# EAGLE board SNCHN_II-02p (EAGLE 5.11), part 1 of 2
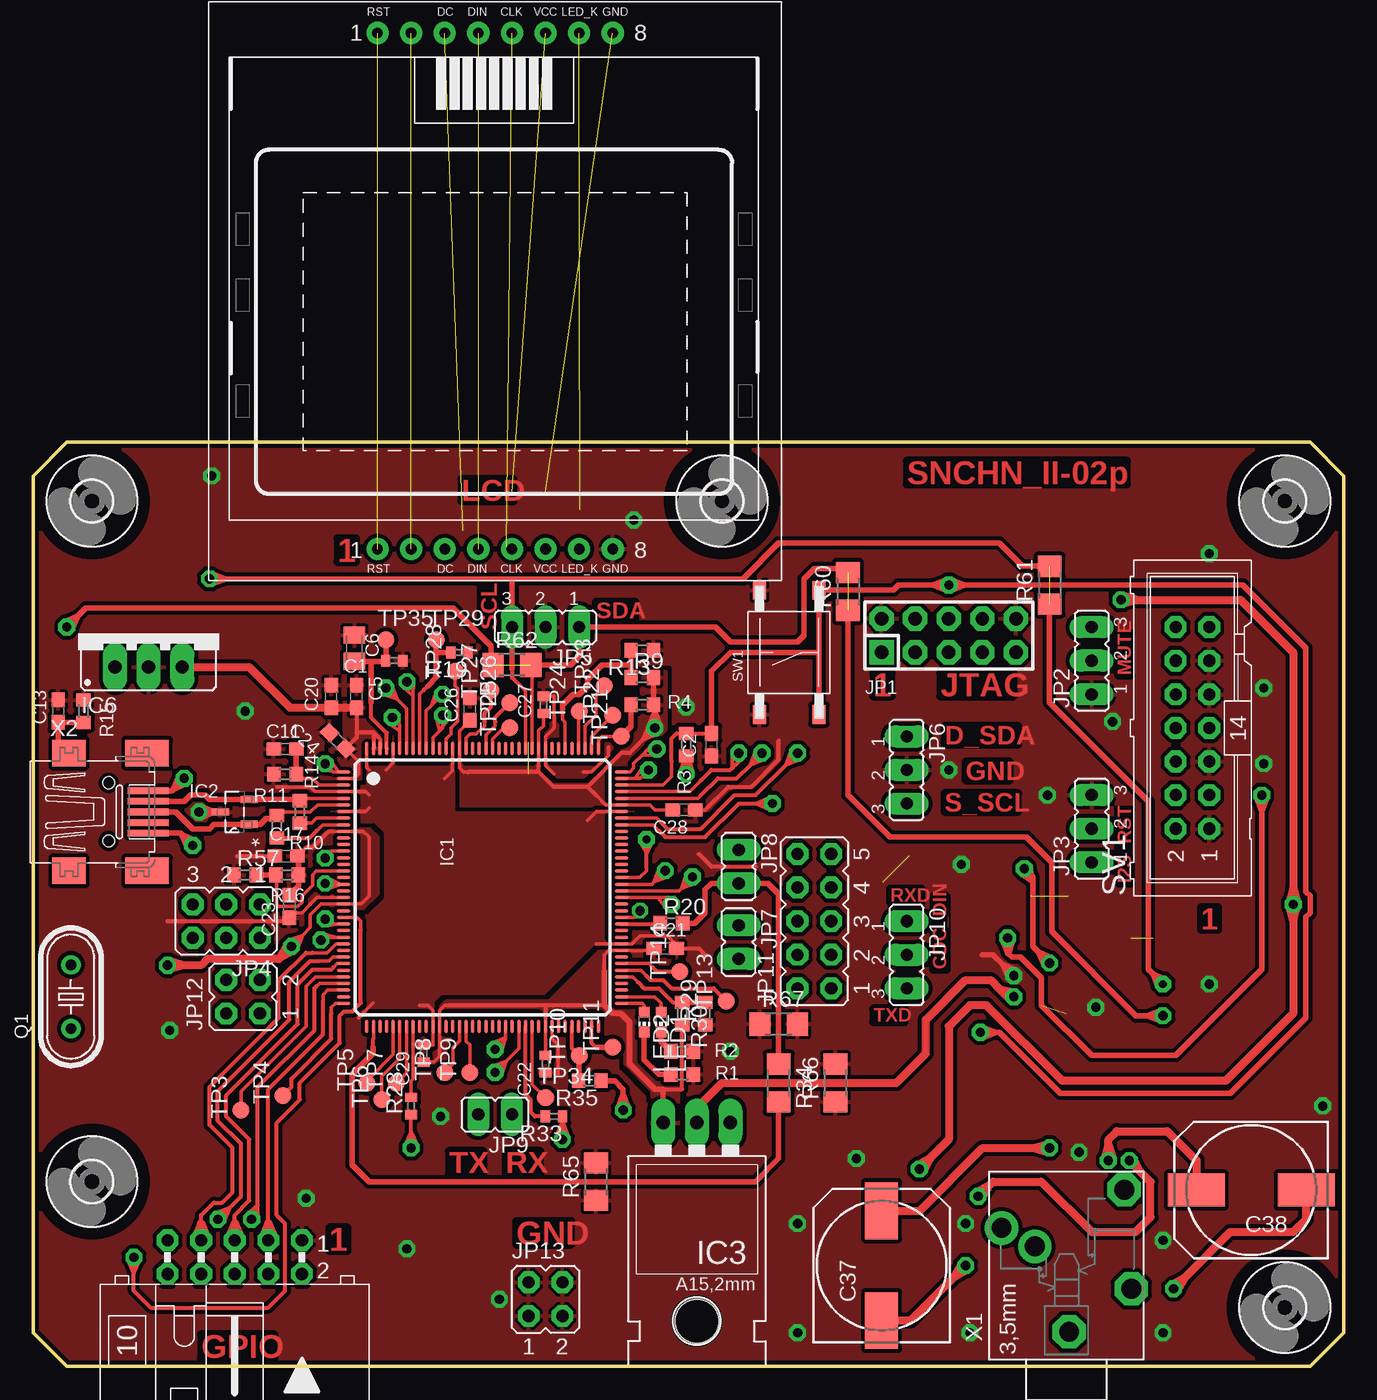
[diagram p2: board, top side]
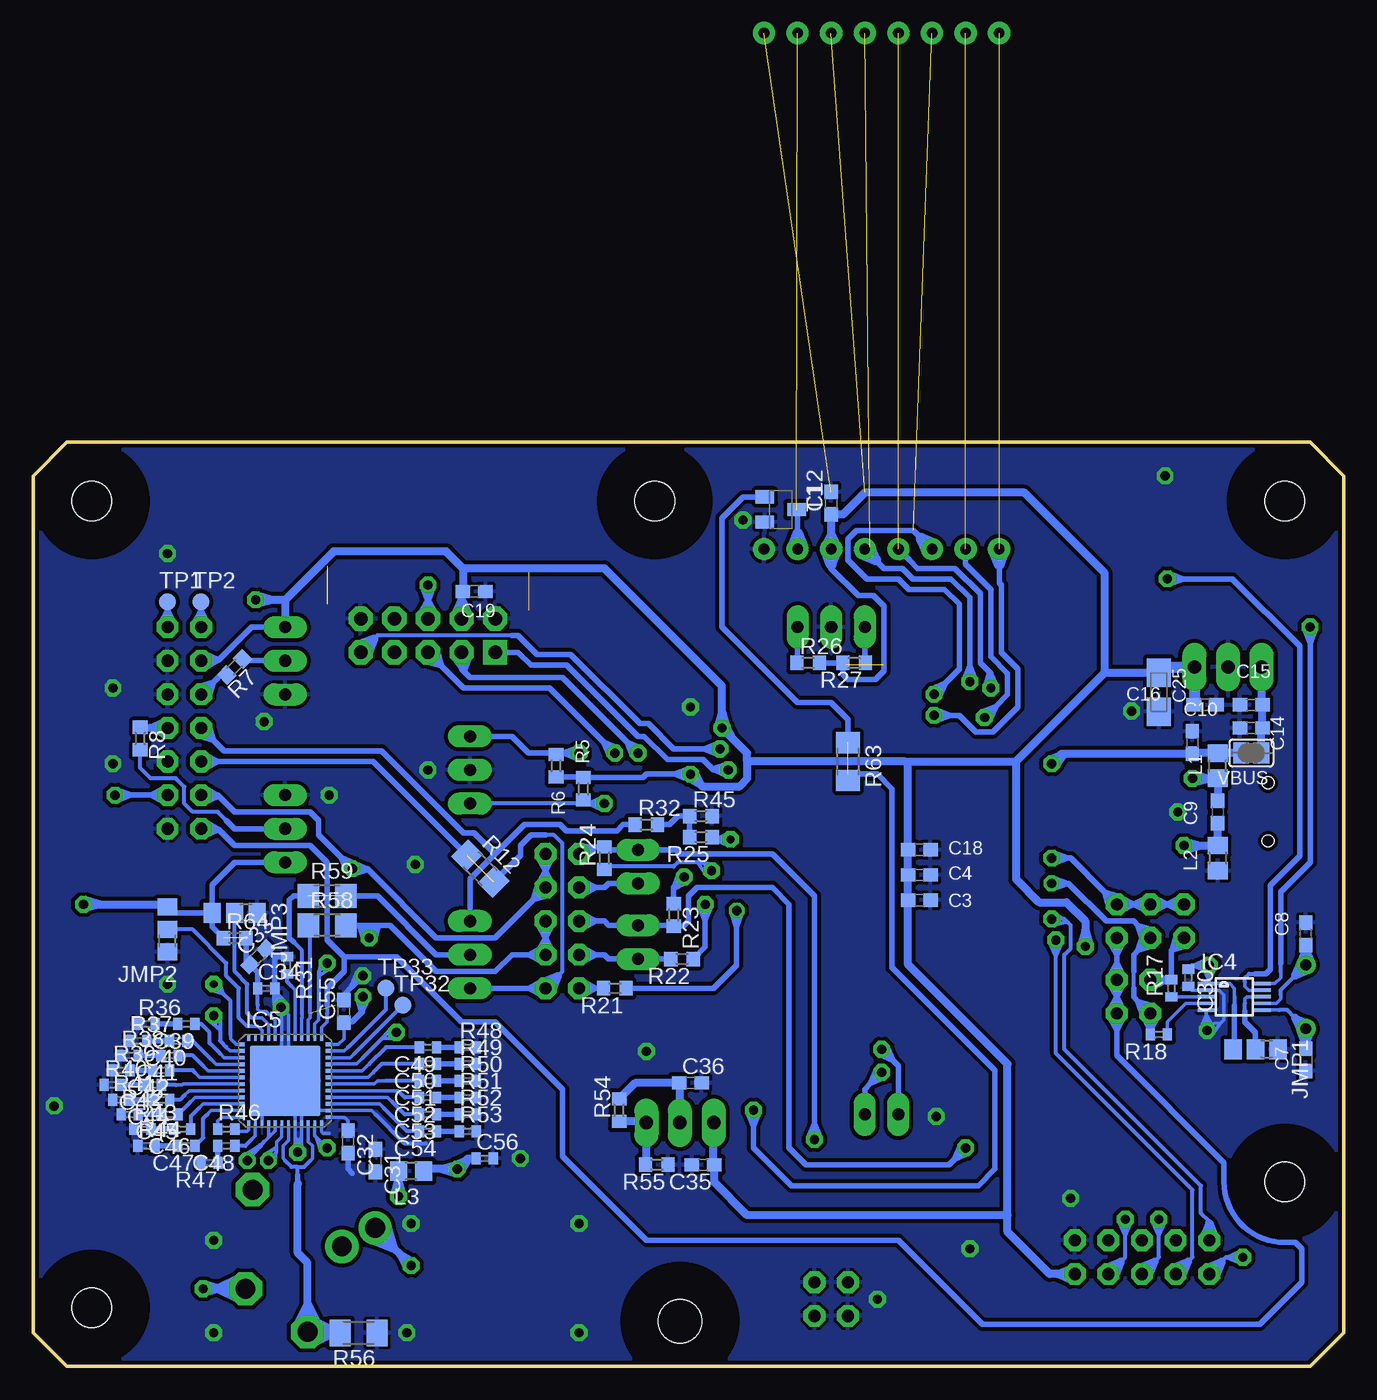
[diagram p3: board, bottom side, seen from below]

Size 99.06 x 69.85 mm. Coordinates in mm from the lower left corner, seen from the top.
Outline: 0,2.54 2.54,0 96.52,0 99.06,2.54 99.06,67.31 96.52,69.85 2.54,69.85 0,67.31 0,2.54
Copper layers (1*16): Top 0.035mm / dielectric 1.5mm / Bottom 0.035mm
Design rules "default *": minimum track width 0.2mm, minimum drill 0.5mm, track to track 0.2mm, track to pad 0.2mm, pad to pad 0.2mm, via to via 0.2mm, smd to smd 0.2mm, copper to edge 0.3mm, drill to drill 8mil, minimum pad ring 10mil, minimum via ring 8mil, stop-mask expansion 4mil, vias tented up to drill 0.6mm, thermal gap 10mil
tRestrict: area 25.6,45.7 to 26.8,45.9; area 27.6,45.7 to 31.3,45.9; area 32.7,45.7 to 37.8,45.9; area 39.2,45.7 to 42.7,45.9; area 43.5,42.9 to 43.7,45.1; area 43.5,32.4 to 43.7,41.6; area 43.5,27.5 to 43.7,31; area 39.2,26.5 to 42.9,26.7; area 31.1,26.5 to 38.3,26.7; area 25.4,26.5 to 29.8,26.7; area 24.3,27.6 to 24.4,33.5; area 24.3,35.4 to 24.4,40; 3 more areas

## Footprints (pad centres in the part's own frame; a part is rotated, then mirrored left to right if it is on the bottom)
C0603 = smd 1.1 x 1: 1 -0.85,0; 2 0.85,0
C0402 = smd 0.7 x 0.9: 1 -0.65,0; 2 0.65,0
C0805K = smd 1.3 x 1.6: 1 -1,0; 2 1,0
A/3216-18W = smd 2.15 x 1.8: + 1.475,0; - -1.475,0
140CLH-1010 = smd 4.3 x 2.5: + 4.15,0; - -4.15,0
LCD_NOKIA_5510_PLUS_EXT_BRD = drill 0.8 pad 1.676 round: 1 -8.89,19.5; 1@1 -8.89,-19.5; 2 -6.35,19.5; 2@1 -6.35,-19.5; 3 -3.81,19.5; 3@1 -3.81,-19.5; 4 -1.27,19.5; 4@1 -1.27,-19.5; 5 1.27,19.5; 5@1 1.27,-19.5; 6 3.81,19.5; 6@1 3.81,-19.5; 7 6.35,19.5; 7@1 6.35,-19.5; 8 8.89,19.5; 8@1 8.89,-19.5
LQFP144 = smd 0.25 x 1: 1 -8.75,-10.5; 2 -8.25,-10.5; 3 -7.75,-10.5; 4 -7.25,-10.5; 5 -6.75,-10.5; 6 -6.25,-10.5; 7 -5.75,-10.5; 8 -5.25,-10.5; 9 -4.75,-10.5; 10 -4.25,-10.5; 11 -3.75,-10.5; 12 -3.25,-10.5; 13 -2.75,-10.5; 14 -2.25,-10.5; 15 -1.75,-10.5; 16 -1.25,-10.5; 17 -0.75,-10.5; 18 -0.25,-10.5; 19 0.25,-10.5; 20 0.75,-10.5; 21 1.25,-10.5; 22 1.75,-10.5; 23 2.25,-10.5; 24 2.75,-10.5; 25 3.25,-10.5; 26 3.75,-10.5; 27 4.25,-10.5; 28 4.75,-10.5; 29 5.25,-10.5; 30 5.75,-10.5; 31 6.25,-10.5; 32 6.75,-10.5; 33 7.25,-10.5; 34 7.75,-10.5; 35 8.25,-10.5; 36 8.75,-10.5; 73 8.75,10.5; 74 8.25,10.5; 75 7.75,10.5; 76 7.25,10.5; 77 6.75,10.5; 78 6.25,10.5; 79 5.75,10.5; 80 5.25,10.5; 81 4.75,10.5; 82 4.25,10.5; 83 3.75,10.5; 84 3.25,10.5; 85 2.75,10.5; 86 2.25,10.5; 87 1.75,10.5; 88 1.25,10.5; 89 0.75,10.5; 90 0.25,10.5; 91 -0.25,10.5; 92 -0.75,10.5; 93 -1.25,10.5; 94 -1.75,10.5; 95 -2.25,10.5; 96 -2.75,10.5; 97 -3.25,10.5; 98 -3.75,10.5; 99 -4.25,10.5; 100 -4.75,10.5; 101 -5.25,10.5; 102 -5.75,10.5; 103 -6.25,10.5; 104 -6.75,10.5; 105 -7.25,10.5; 106 -7.75,10.5; 107 -8.25,10.5; 108 -8.75,10.5 | smd 1 x 0.25: 37 10.5,-8.75; 38 10.5,-8.25; 39 10.5,-7.75; 40 10.5,-7.25; 41 10.5,-6.75; 42 10.5,-6.25; 43 10.5,-5.75; 44 10.5,-5.25; 45 10.5,-4.75; 46 10.5,-4.25; 47 10.5,-3.75; 48 10.5,-3.25; 49 10.5,-2.75; 50 10.5,-2.25; 51 10.5,-1.75; 52 10.5,-1.25; 53 10.5,-0.75; 54 10.5,-0.25; 55 10.5,0.25; 56 10.5,0.75; 57 10.5,1.25; 58 10.5,1.75; 59 10.5,2.25; 60 10.5,2.75; 61 10.5,3.25; 62 10.5,3.75; 63 10.5,4.25; 64 10.5,4.75; 65 10.5,5.25; 66 10.5,5.75; 67 10.5,6.25; 68 10.5,6.75; 69 10.5,7.25; 70 10.5,7.75; 71 10.5,8.25; 72 10.5,8.75; 109 -10.5,8.75; 110 -10.5,8.25; 111 -10.5,7.75; 112 -10.5,7.25; 113 -10.5,6.75; 114 -10.5,6.25; 115 -10.5,5.75; 116 -10.5,5.25; 117 -10.5,4.75; 118 -10.5,4.25; 119 -10.5,3.75; 120 -10.5,3.25; 121 -10.5,2.75; 122 -10.5,2.25; 123 -10.5,1.75; 124 -10.5,1.25; 125 -10.5,0.75; 126 -10.5,0.25; 127 -10.5,-0.25; 128 -10.5,-0.75; 129 -10.5,-1.25; 130 -10.5,-1.75; 131 -10.5,-2.25; 132 -10.5,-2.75; 133 -10.5,-3.25; 134 -10.5,-3.75; 135 -10.5,-4.25; 136 -10.5,-4.75; 137 -10.5,-5.25; 138 -10.5,-5.75; 139 -10.5,-6.25; 140 -10.5,-6.75; 141 -10.5,-7.25; 142 -10.5,-7.75; 143 -10.5,-8.25; 144 -10.5,-8.75
SOT95P237X112-3N = smd 1.321 x 0.559: 1 -1.092,0.94; 2 -1.092,-0.94; 3 1.092,0
TO220L1 = drill 1.016 long: 1 -2.54,-3.81; 2 0,-3.81; 3 2.54,-3.81 | hole 3.302: 0,11.176
MSOP10 = smd 0.25 x 1.3: 1 -1,-2.113; 2 -0.5,-2.113; 3 0,-2.113; 4 0.5,-2.113; 5 1,-2.113; 6 1,2.113; 7 0.5,2.113; 8 0,2.113; 9 -0.5,2.113; 10 -1,2.113
QFN48 = smd 0.55 x 0.3: 1 -3.275,2.75; 2 -3.275,2.25; 3 -3.275,1.75; 4 -3.275,1.25; 5 -3.275,0.75; 6 -3.275,0.25; 7 -3.275,-0.25; 8 -3.275,-0.75; 9 -3.275,-1.25; 10 -3.275,-1.75; 11 -3.275,-2.25; 12 -3.275,-2.75; 25 3.275,-2.75; 26 3.275,-2.25; 27 3.275,-1.75; 28 3.275,-1.25; 29 3.275,-0.75; 30 3.275,-0.25; 31 3.275,0.25; 32 3.275,0.75; 33 3.275,1.25; 34 3.275,1.75; 35 3.275,2.25; 36 3.275,2.75 | smd 0.3 x 0.55: 13 -2.75,-3.275; 14 -2.25,-3.275; 15 -1.75,-3.275; 16 -1.25,-3.275; 17 -0.75,-3.275; 18 -0.25,-3.275; 19 0.25,-3.275; 20 0.75,-3.275; 21 1.25,-3.275; 22 1.75,-3.275; 23 2.25,-3.275; 24 2.75,-3.275; 37 2.75,3.275; 38 2.25,3.275; 39 1.75,3.275; 40 1.25,3.275; 41 0.75,3.275; 42 0.25,3.275; 43 -0.25,3.275; 44 -0.75,3.275; 45 -1.25,3.275; 46 -1.75,3.275; 47 -2.25,3.275; 48 -2.75,3.275 | smd 5.309 x 5.309: EXP 0,0
78XXS = drill 1.016 long: GND 0,-2.54; IN -2.54,-2.54; OUT 2.54,-2.54
A0R-JMP = smd 1.5 x 1.3: 1 0,1.7; 2 0,0; 3 0,-1.7
AVR-JTAG-10 = drill 1.016 square: 1 -5.08,-1.27 | drill 1.016 octagon: 2 -5.08,1.27; 3 -2.54,-1.27; 4 -2.54,1.27; 5 0,-1.27; 6 0,1.27; 7 2.54,-1.27; 8 2.54,1.27; 9 5.08,-1.27; 10 5.08,1.27
JP2 = drill 0.914 long: 1 -2.54,0; 2 0,0; 3 2.54,0
JP3Q = drill 0.914 octagon: 1 -2.54,-1.27; 2 -2.54,1.27; 3 0,-1.27; 4 0,1.27; 5 2.54,-1.27; 6 2.54,1.27
JP1 = drill 0.914 long: 1 0,-1.27; 2 0,1.27
JP5Q = drill 0.914 octagon: 1 -5.08,-1.27; 2 -5.08,1.27; 3 -2.54,-1.27; 4 -2.54,1.27; 5 0,-1.27; 6 0,1.27; 7 2.54,-1.27; 8 2.54,1.27; 9 5.08,-1.27; 10 5.08,1.27
JP2Q = drill 0.914 octagon: 1 -1.27,-1.27; 2 -1.27,1.27; 3 1.27,-1.27; 4 1.27,1.27
L0805 = smd 1.3 x 1.5: 1 -0.95,0; 2 0.95,0
CHIP-LED0603 = smd 0.8 x 0.8: A 0,-0.75; C 0,0.75
HC49U-V = drill 0.813 round: 1 -2.413,0; 2 2.413,0
R0603 = smd 1 x 1.1: 1 -0.85,0; 2 0.85,0
R1206 = smd 1.6 x 1.803: 1 -1.422,0; 2 1.422,0
R0402 = smd 0.7 x 0.9: 1 -0.65,0; 2 0.65,0
M1206 = smd 1.6 x 2: 1 -1.4,0; 2 1.4,0
ML14 = drill 0.914 octagon: 1 -7.62,-1.27; 2 -7.62,1.27; 3 -5.08,-1.27; 4 -5.08,1.27; 5 -2.54,-1.27; 6 -2.54,1.27; 7 0,-1.27; 8 0,1.27; 9 2.54,-1.27; 10 2.54,1.27; 11 5.08,-1.27; 12 5.08,1.27; 13 7.62,-1.27; 14 7.62,1.27
ML10L = drill 0.914 octagon: 1 -5.08,-1.27; 2 -5.08,1.27; 3 -2.54,-1.27; 4 -2.54,1.27; 5 0,-1.27; 6 0,1.27; 7 2.54,-1.27; 8 2.54,1.27; 9 5.08,-1.27; 10 5.08,1.27
B1720/SMD = smd 1.4 x 1: P$1 4.7,-2.25; P$2 -4.7,-2.25; P$3 4.7,2.25; P$4 -4.7,2.25
SC59-BEC = smd 1 x 1.4: B -0.95,-1.2; C 0,1.2; E 0.95,-1.2
B1,27 = smd 1.27 x 1.27: TP 0,0
3,0 = hole 3: 0,0
SJ = smd 1.168 x 1.6: 1 -0.762,0; 2 0.762,0
PG203J = drill 1.499 octagon: 1 -5.004,-0.203; 4 5.74,-4.369; 5 -1.753,-4.902 | drill 1.499 round: 2 2.845,4.902; 3 1.448,2.388
32005-201 = smd 3.1 x 0.5: 1 3,1.6; 2 3,0.8; 3 3,0; 4 3,-0.8; 5 3,-1.6 | smd 2.5 x 2: M1 -3,-4.45; M2 -3,4.45 | smd 3.3 x 2: M3 2.9,4.45; M4 2.9,-4.45 | hole 0.9: 0,2.2; 0,-2.2

## Placement (x,y rotation side)
C1  100n  [C0603]  24.45,50.64 90 top
C2  220n  [C0603]  51.28,46.99 270 top
C3  1u  [C0603]  32.07,35.24 0 bottom
C4  1n  [C0603]  32.07,37.15 0 bottom
C5  1n  [C0402]  27.3,53.34 0 top
C6  2u  [C0805K]  24.29,54.29 90 top
C7  10p(22p)  [C0603]  2.86,23.18 270 bottom
C8  10p(22p)  [C0603]  2.86,32.7 90 bottom
C9  1n  [C0603]  9.53,41.91 270 bottom
C10  100n  [C0603]  11.43,47.15 90 bottom
C11  10pF(22p)  [C0603]  19.05,46.67 180 top
C12  1u  [C0603]  38.73,65.25 90 bottom
C13  10n  [C0603]  1.91,49.53 90 top
C14  1u  [C0603]  6.99,48.26 180 bottom
C15  100n  [C0603]  6.99,50.01 180 bottom
C16  4.7u  [A/3216-18W]  13.97,50.96 90 bottom
C17  100n  [C0603]  19.14,38.58 180 top
C18  1u  [C0603]  32.07,39.05 0 bottom
C19  1u  [C0603]  65.72,58.58 0 bottom
C20  1u  [C0603]  22.54,50.64 90 top
C21  100n  [C0603]  47.78,31.59 0 top
C22  100n  [C0402]  38.73,22.86 270 top
C23  100n  [C0603]  19.37,34.77 270 top
C24  1n  [C0603]  23.02,47.31 135 top
C25  100n  [C0603]  10.48,50.01 0 bottom
C26  100n  [C0603]  33.02,49.69 90 top
C27  100n  [C0402]  38.58,50.01 90 top
C28  100n  [C0603]  49.21,42.07 0 top
C29  100n  [C0402]  29.53,23.65 90 top
C30  100n  [C0402]  11.75,29.37 270 bottom
C31  1u  [C0603]  73.18,15.56 270 bottom
C32  100n  [C0603]  75.25,16.99 270 bottom
C33  1u  [C0603]  82.07,30.96 45 bottom
C34  100n  [C0402]  81.44,28.57 0 bottom
C35  100n  [C0603]  48.42,15.24 180 bottom
C36  100n  [C0603]  49.37,21.43 0 bottom
C37  220uF  [140CLH-1010]  64.13,7.62 90 top
C38  220uF  [140CLH-1010]  92.07,13.34 180 top
C39  220n  [C0402]  87.47,25.88 180 bottom
C40  220n  [C0402]  88.11,24.61 180 bottom
C41  220n  [C0402]  88.74,23.5 180 bottom
C42  220n  [C0402]  89.38,22.38 180 bottom
C43  220n  [C0402]  90.01,21.27 180 bottom
C44  220n  [C0402]  89.38,20.16 180 bottom
C45  220n  [C0402]  88.74,19.05 180 bottom
C46  220n  [C0402]  87.79,17.94 180 bottom
C47  220n  [C0402]  87.47,16.67 180 bottom
C48  220n  [C0402]  84.46,16.67 180 bottom
C49  220n  [C0402]  69.21,24.13 180 bottom
C50  220n  [C0402]  69.21,22.86 180 bottom
C51  220n  [C0402]  69.21,21.59 180 bottom
C52  220n  [C0402]  69.21,20.32 180 bottom
C53  220n  [C0402]  69.21,19.05 180 bottom
C54  220n  [C0402]  69.21,17.78 180 bottom
C55  100n  [C0603]  75.56,26.83 90 bottom
C56  10n  [C0402]  64.93,15.72 0 bottom
DIS1  LCD_NOKIA_5510  [LCD_NOKIA_5510_PLUS_EXT_BRD]  34.93,81.28 0 top
IC1  AT32UC3A3256  [LQFP144]  33.97,36.2 270 top
IC2  TPD2E009DBZR  [SOT95P237X112-3N]  15.24,41.91 180 top
IC3  LM317MABT  [TO220L1]  50.16,14.61 180 top
IC4  CS2200  [MSOP10]  8.26,27.94 270 bottom
IC5  TLV320AIC33  [QFN48]  80.01,21.59 0 bottom
IC6  LF33CV  [78XXS]  8.73,55.4 0 top
JMP1  0R-JUMPA  [A0R-JMP]  6.67,23.97 270 bottom
JMP2  0R-JUMPA  [A0R-JMP]  88.9,33.02 180 bottom
JMP3  0R-JUMPA  [A0R-JMP]  83.82,34.29 270 bottom
JP1  AVR-JTAG-10  [AVR-JTAG-10]  69.21,55.24 0 top
JP2  Mute switch  [JP2]  80.01,53.34 90 top
JP3  Reset switch  [JP2]  80.01,40.64 90 top
JP4  MCLK MCU source  [JP3Q]  14.61,33.66 180 top
JP5  I2C 0 probe  [JP2]  38.73,55.88 180 top
JP6  I2C 1 probe  [JP2]  66.04,45.09 270 top
JP7  Common FRAME SYNC  [JP1]  53.34,32.07 180 top
JP8  Common BCLK  [JP1]  53.34,37.78 180 top
JP9  [JP1]  34.93,19.05 90 top
JP10  Data_source  [JP2]  66.04,31.11 270 top
JP11  I2S connect options  [JP5Q]  59.05,33.66 90 top
JP12  MCLK source  [JP2Q]  15.88,27.94 90 top
JP13  GND pads  [JP2Q]  38.73,5.08 0 top
L1  33u  [L0805]  9.53,45.4 90 bottom
L2  33u  [L0805]  9.53,38.42 270 bottom
L3  33u  [L0805]  70.48,14.76 180 bottom
LED1  [CHIP-LED0603]  47.47,26.04 180 top
LED2  [CHIP-LED0603]  46.2,26.04 180 top
Q1  12MHz  [HC49U-V]  2.86,27.94 270 top
R1  470  [R0603]  49.05,22.07 0 top
R2  470  [R0603]  49.05,23.81 0 top
R3  10k  [R0603]  49.37,46.99 270 top
R4  4k7  [R0603]  46.04,50.01 0 top
R5  4k7  [R0603]  57.47,43.66 90 bottom
R6  4k7  [R0603]  59.53,45.4 270 bottom
R7  470R  [R0603]  83.82,52.86 225 bottom
R8  470R  [R0603]  90.96,47.47 270 bottom
R9  //10k  [R0603]  46.04,52.07 0 top
R10  39R(33R)  [R0603]  20.16,41.91 270 top
R11  39R(33R)  [R0603]  18.41,40.8 270 top
R12  0R  [R1206]  65.25,37.62 315 bottom
R13  //10k  [R0603]  46.04,54.13 180 top
R14  6k8  [R0603]  19.05,44.77 0 top
R15  1M  [R0603]  3.81,49.53 270 top
R16  10k  [R0603]  19.21,37.15 0 top
R17  33R  [R0402]  13.02,28.57 90 bottom
R18  33R  [R0402]  13.97,25.08 180 bottom
R19  2k2  [R0402]  32.23,53.98 180 top
R20  33R  [R0603]  48.26,33.5 0 top
R21  33R  [R0603]  55.09,28.58 180 bottom
R22  33R  [R0603]  50.01,30.8 180 bottom
R23  33R  [R0603]  50.64,34.13 270 bottom
R24  33R  [R0603]  55.88,38.42 90 bottom
R25  0R  [R0603]  48.58,40.01 180 bottom
R26  4k7  [R0603]  40.48,53.18 0 bottom
R27  4k7  [R0603]  36.99,53.18 180 bottom
R28  //0R  [R0402]  28.57,19.68 90 top
R29  //10k  [R0603]  50.8,26.67 90 top
R30  10k  [R0603]  49.05,26.67 270 top
R31  //100k  [R0402]  79.85,30.32 270 bottom
R32  33R  [R0603]  52.71,40.96 0 bottom
R33  //0R  [R0402]  39.37,18.89 180 top
R34  //0R  [R1206]  56.36,21.43 270 top
R35  22R  [R0603]  42.07,21.59 180 top
R36  33R  [R0402]  90.49,25.88 0 bottom
R37  33R  [R0402]  91.12,24.61 0 bottom
R38  33R  [R0402]  91.76,23.5 0 bottom
R39  33R  [R0402]  92.39,22.38 0 bottom
R40  33R  [R0402]  93.03,21.27 0 bottom
R41  33R  [R0402]  92.39,20.16 0 bottom
R42  33R  [R0402]  91.76,19.05 0 bottom
R43  33R  [R0402]  90.8,17.94 0 bottom
R44  33R  [R0402]  90.49,16.67 0 bottom
R45  10k  [R0603]  48.58,41.59 0 bottom
R46  10k  [R0402]  84.45,17.94 0 bottom
R47  33R  [R0402]  85.73,15.4 180 bottom
R48  10k  [R0402]  66.2,24.13 0 bottom
R49  10k  [R0402]  66.2,22.86 0 bottom
R50  10k  [R0402]  66.2,21.59 0 bottom
R51  10k  [R0402]  66.2,20.32 0 bottom
R52  10k  [R0402]  66.2,19.05 0 bottom
R53  10k  [R0402]  66.2,17.78 0 bottom
R54  560R  [R0603]  54.77,19.37 90 bottom
R55  220R  [R0603]  51.91,15.24 180 bottom
R56  //0R  [M1206]  74.45,2.54 180 bottom
R57  //330R  [R0603]  16.03,37.15 0 top
R58  0R  [R1206]  76.83,33.34 0 bottom
R59  0R  [R1206]  76.83,35.56 0 bottom
R60  0R  [R1206]  61.59,58.58 90 top
R61  0R  [R1206]  76.83,59.05 90 top
R62  0R  [R1206]  36.2,53.02 0 top
R63  0R  [R1206]  37.47,45.72 270 bottom
R64  0R  [R0603]  83.82,32.38 0 bottom
R65  0R  [R1206]  42.55,13.97 90 top
R66  0R  [R1206]  60.64,21.43 90 top
R67  0R  [R1206]  56.36,25.88 0 top
SV1  I2S CONNECTOR  [ML14]  87.63,48.26 90 top
SV2  GPIO  [ML10L]  15.24,8.26 180 top
SW1  Manual RESET  [B1720/SMD]  57.15,53.98 90 top
T1  KRC402E  [SC59-BEC]  42.55,64.77 270 bottom
TP1  PTR1B1,27  [B1,27]  88.9,57.78 0 bottom
TP2  PTR1B1,27  [B1,27]  86.36,57.78 0 bottom
TP3  PTR1B1,27  [B1,27]  15.72,19.37 90 top
TP4  PTR1B1,27  [B1,27]  18.89,20.48 90 top
TP5  PTR1B1,27  [B1,27]  25.24,21.43 90 top
TP6  PTR1B1,27  [B1,27]  26.35,20.16 90 top
TP7  PTR1B1,27  [B1,27]  27.46,21.43 90 top
TP8  PTR1B1,27  [B1,27]  31.11,22.23 90 top
TP9  PTR1B1,27  [B1,27]  33.02,22.23 90 top
TP10  PTR1B1,27  [B1,27]  41.27,23.5 90 top
TP11  PTR1B1,27  [B1,27]  43.82,24.13 90 top
TP13  PTR1B1,27  [B1,27]  52.39,27.62 90 top
TP14  PTR1B1,27  [B1,27]  48.9,29.84 90 top
TP21  PTR1B1,27  [B1,27]  44.45,47.62 90 top
TP22  PTR1B1,27  [B1,27]  43.82,49.21 90 top
TP23  PTR1B1,27  [B1,27]  43.18,51.44 90 top
TP24  PTR1B1,27  [B1,27]  41.27,49.53 90 top
TP25  PTR1B1,27  [B1,27]  36.04,48.26 90 top
TP26  PTR1B1,27  [B1,27]  36.04,50.16 90 top
TP27  PTR1B1,27  [B1,27]  34.61,51.12 90 top
TP28  PTR1B1,27  [B1,27]  31.91,52.55 90 top
TP29  PTR1B1,27  [B1,27]  30.48,54.93 0 top
TP32  PTR1B1,27  [B1,27]  71.12,27.3 0 bottom
TP33  PTR1B1,27  [B1,27]  72.39,28.57 0 bottom
TP34  PTR1B1,27  [B1,27]  38.73,20.32 0 top
TP35  PTR1B1,27  [B1,27]  26.67,54.93 0 top
U$1  [3,0]  4.45,65.41 0 top
U$2  [3,0]  94.61,65.41 0 top
U$3  [3,0]  4.45,13.97 0 top
U$4  [3,0]  94.61,4.45 0 top
U$5  [3,0]  52.07,65.41 0 top
VBUS  [SJ]  6.99,46.35 180 bottom
X1  PG203J  [PG203J]  78.1,7.62 90 top
X2  MINI-USB-SHIELD  [32005-201]  5.71,41.91 0 top